# EasyEDA schematic SCH_Beginner project_2021-07-14.json
TITLE: Sheet_1; REV: 1.0; Date: 2021-06-19; Sheet: 1/1; Drawn By: jtan478; Company: Your Company
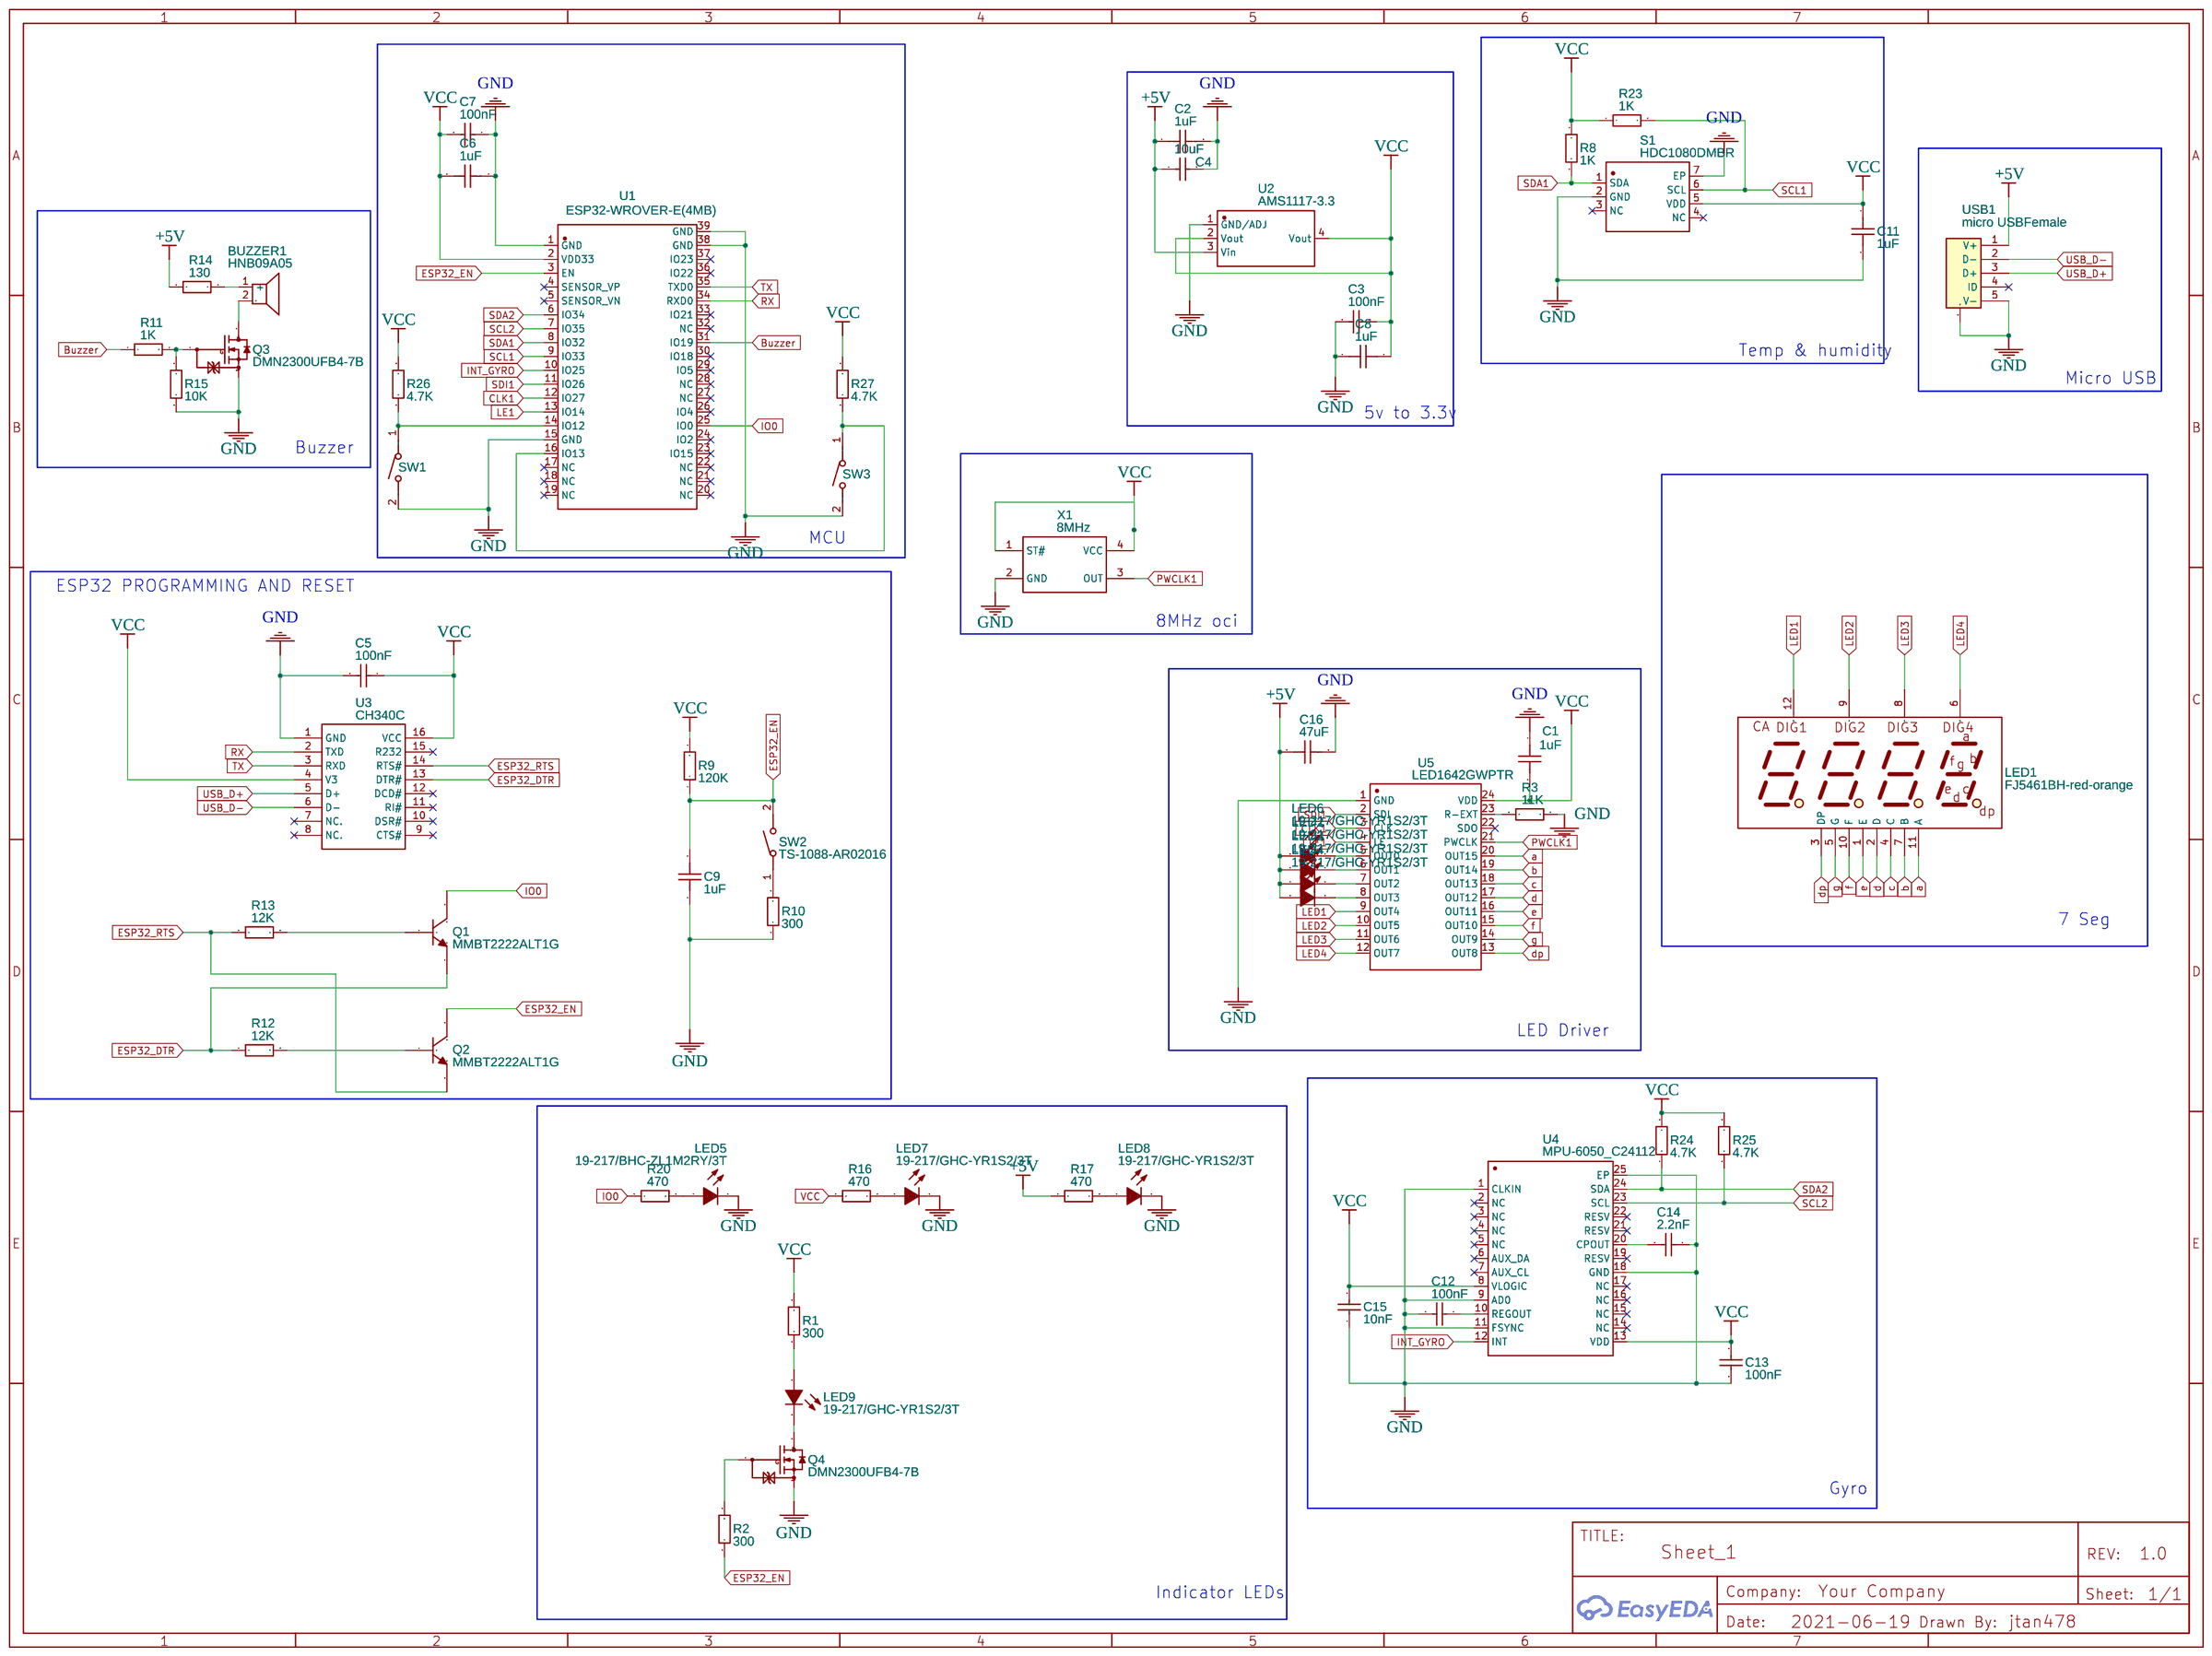
[diagram p0: schematic sheet]

## Parts
BUZZER1  HNB09A05  [BUZ-TH_BD9.6-P5.00-D0.7-FD]
C1  1uF  [C0402]
C2  1uF  [C0402]
C3  100nF  [C0402]
C4  10uF  [C0402]
C5  100nF  [C0402]
C6  1uF  [C0402]
C7  100nF  [C0402]
C8  1uF  [C0402]
C9  1uF  [C0402]
C11  1uF  [C0402]
C12  100nF  [C0402]
C13  100nF  [C0402]
C14  2.2nF  [C0402]
C15  10nF  [C0402]
C16  47uF  [C1206]
LED1  FJ5461BH-red-orange  [LED-SEG-TH_FJ5461AH]
LED2  19-217/GHC-YR1S2/3T  [LED0603-R-RD]
LED3  19-217/GHC-YR1S2/3T  [LED0603-R-RD]
LED4  19-217/GHC-YR1S2/3T  [LED0603-R-RD]
LED5  19-217/BHC-ZL1M2RY/3T  [LED0603-R-RD]
LED6  19-217/GHC-YR1S2/3T  [LED0603-R-RD]
LED7  19-217/GHC-YR1S2/3T  [LED0603-R-RD]
LED8  19-217/GHC-YR1S2/3T  [LED0603-R-RD]
LED9  19-217/GHC-YR1S2/3T  [LED0603-R-RD]
Q1  MMBT2222ALT1G  [SOT-23-3_L2.9-W1.3-P1.90-LS2.4-BR]
Q2  MMBT2222ALT1G  [SOT-23-3_L2.9-W1.3-P1.90-LS2.4-BR]
Q3  DMN2300UFB4-7B  [X2-DFN1006-3_L1.0-W0.6-P0.35-BL]
Q4  DMN2300UFB4-7B  [X2-DFN1006-3_L1.0-W0.6-P0.35-BL]
R1  300  [R0402]
R2  300  [R0402]
R3  11K  [R0603]
R8  1K  [R0603]
R9  120K  [R0402]
R10  300  [R0402]
R11  1K  [R0603]
R12  12K  [R0402]
R13  12K  [R0402]
R14  130  [R0603]
R15  10K  [R0603]
R16  470  [R0402]
R17  470  [R0402]
R20  470  [R0402]
R23  1K  [R0603]
R24  4.7K  [R0402]
R25  4.7K  [R0402]
R26  4.7K  [R0402]
R27  4.7K  [R0402]
S1  HDC1080DMBR  [SENSOR-SMD_HDC1080DMBR]
SW1  TS-1088-AR02016  [SW-SMD_L4.0-W2.9-LS5.0]
SW2  TS-1088-AR02016  [SW-SMD_L4.0-W2.9-LS5.0]
SW3  TS-1088-AR02016  [SW-SMD_L4.0-W2.9-LS5.0]
U1  ESP32-WROVER-E(4MB)  [WIFIM-SMD_39P-L31.4-W18.0-P1.27]
U2  AMS1117-3.3  [SOT-223-3_L6.5-W3.4-P2.30-LS7.0-BR]
U3  CH340C  [SOP-16_L10.0-W3.9-P1.27-LS6.0-BL]
U4  MPU-6050_C24112  [QFN-24_L4.0-W4.0-P0.50-BL-EP2.6]
U5  LED1642GWPTR  [QSOP-24_L8.7-W4.0-P0.65-LS6.0-BL]
USB1  micro USBFemale  [MICRO-USB-SMD_5P-P0.65-H-F_C10418]
X1  8MHz  [OSC-SMD_4P-L3.2-W2.5-BL]

## Library data of the parts
BUZZER1 = HNB09A05: Supplier: LCSC; Manufacturer: HNDZ; Supplier Part: C96493; JLCPCB Part Class: Extended Part
C1 C2 C8 C11 = CL05A105KA5NQNC: Supplier: LCSC; Manufacturer: SAMSUNG; Supplier Part: C52923; JLCPCB Part Class: Basic Part
C3 C5 C7 C12 C13 = CL05B104KO5NNNC: Supplier: LCSC; Manufacturer: SAMSUNG; LCSC Assembly: Yes; Supplier Part: C1525; SMT Type: Basic
C4 = CL05A106MQ5NUNC: Supplier: LCSC; Manufacturer: SAMSUNG; Supplier Part: C15525; JLCPCB Part Class: Basic Part
C6 C9 = CL05A105KA5NQNC: Supplier: LCSC; Manufacturer: SAMSUNG; LCSC Assembly: Yes; Supplier Part: C52923; SMT Type: Basic
C14 = 0402B222K500NT: Supplier: LCSC; Manufacturer: FH; LCSC Assembly: Yes; Supplier Part: C1531; SMT Type: Basic
C15 = CL05B103KB5NNNC: Supplier: LCSC; Manufacturer: SAMSUNG; Supplier Part: C15195; JLCPCB Part Class: Basic Part
C16 = CL31A476MPHNNNE: Supplier: LCSC; Manufacturer: SAMSUNG; Supplier Part: C96123; JLCPCB Part Class: Basic Part
LED1 = FJ5461BH-red-orange: Supplier: LCSC; Manufacturer: ReliaPro; Manufacturer Part: FJ5461BH 橙红; Supplier Part: C10713; JLCPCB Part Class: Extended Part
LED2-LED4 LED6-LED9 = 19-217/GHC-YR1S2/3T: Supplier: LCSC; Manufacturer: EVERLIGHT; Supplier Part: C72043; JLCPCB Part Class: Basic Part
LED5 = 19-217/BHC-ZL1M2RY/3T: Supplier: LCSC; Manufacturer: EVERLIGHT; Supplier Part: C72041; JLCPCB Part Class: Basic Part
Q1 Q2 = MMBT2222ALT1G: Supplier: LCSC; Manufacturer: ON; image: //image.lceda.cn/szlcsc/C82460.jpg; Supplier Part: C82460; LCSC Assembly: Yes; SMT Type: Extend
Q3 Q4 = DMN2300UFB4-7B: Supplier: LCSC; Manufacturer: DIODES; Contributor: LCSC; Supplier Part: C154728; JLCPCB Part Class: Extended Part
R1 R2 R10 = 0402WGF3000TCE: Supplier: LCSC; Manufacturer: UniOhm; LCSC Assembly: Yes; Supplier Part: C25102; SMT Type: Basic
R3 = 0603WAF1102T5E: Supplier: LCSC; Manufacturer: UniOhm; Supplier Part: C25950; JLCPCB Part Class: Basic Part
R8 R11 R23 = 0603WAF1001T5E: Supplier: LCSC; Manufacturer: UniOhm; Supplier Part: C21190; JLCPCB Part Class: Basic Part
R9 = 0402WGF1203TCE: Supplier: LCSC; Manufacturer: UniOhm; LCSC Assembly: Yes; Supplier Part: C25750; SMT Type: Basic
R12 R13 = 0402WGF1202TCE: Supplier: LCSC; Manufacturer: UniOhm; LCSC Assembly: Yes; Supplier Part: C25752; SMT Type: Basic
R14 = 0603WAF1300T5E: Supplier: LCSC; Manufacturer: UniOhm; Supplier Part: C22796; JLCPCB Part Class: Basic Part
R15 = 0603WAF1002T5E: Supplier: LCSC; Manufacturer: UniOhm; Supplier Part: C25804; JLCPCB Part Class: Basic Part
R16 R17 R20 = 0402WGF4700TCE: Supplier: LCSC; Manufacturer: UniOhm; LCSC Assembly: Yes; Supplier Part: C25117; SMT Type: Basic
R24-R27 = 0402WGF4701TCE: Supplier: LCSC; Manufacturer: UniOhm; LCSC Assembly: Yes; Supplier Part: C25900; SMT Type: Basic
S1 = HDC1080DMBR: Supplier: LCSC; Manufacturer: TI; Supplier Part: C82227; JLCPCB Part Class: Extended Part
SW1-SW3 = TS-1088-AR02016: Supplier: LCSC; Supplier Part: C720477; Manufacturer: XUNPU; Contributor: LCSC; LCSC Assembly: Yes; SMT Type: Extend; Assembly Type: smtWeld; Paste Type: expand
U1 = ESP32-WROVER-E(4MB): Supplier: LCSC; Supplier Part: C529587; Manufacturer: Espressif Systems; Contributor: LCSC; JLCPCB Part Class: Extended Part
U2 = AMS1117-3.3: sourceId: dwIGgezVh; Supplier: LCSC; Manufacturer: AMS; Supplier Part: C6186; JLCPCB Part Class: Basic Part
U3 = CH340C: Supplier: LCSC; Manufacturer: WCH; Supplier Part: C84681; LCSC Assembly: Yes; SMT Type: Extend
U4 = MPU-6050_C24112: sourceId: 1T5FDZYC8; Supplier: LCSC; Manufacturer: InvenSense; Manufacturer Part: MPU-6050; Supplier Part: C24112; JLCPCB Part Class: Basic Part
U5 = LED1642GWPTR: Supplier: LCSC; Manufacturer: STMicroelectronics; Supplier Part: C131193; JLCPCB Part Class: Extended Part
USB1 = micro USBFemale: Supplier: LCSC; Manufacturer: ValuePro; Supplier Part: C10418; JLCPCB Part Class: Extended Part
X1 = Q33310F70055100: Supplier: LCSC; Manufacturer: EPSON; Supplier Part: C70556; JLCPCB Part Class: Extended Part

## Nets
+5V: C2.1 C4.1 C16.1 LED2.1(A) LED3.1(A) LED4.1(A) LED6.1(A) R14.1 R17.1 U2.3(Vin) USB1.1(V+)
GND: C1.1 C2.2 C3.2 C4.2 C5.2 C6.1 C7.1 C8.1 C9.1 C11.2 C12.2 C13.2 C14.1 C15.1 C16.2 LED5.2(C) LED7.2(C) LED8.2(C) Q3.3(S) Q4.3(S) R3.2 R10.1 R15.2 S1.2(GND) S1.7(EP) SW1.2 SW3.2 U1.1(GND) U1.15(GND) U1.38(GND) U1.39(GND) U2.1(GND/ADJ) U3.1(GND) U4.1(CLKIN) U4.9(AD0) U4.11(FSYNC) U4.18(GND) U4.25(EP) U5.1(GND) USB1.0(MTN) USB1.5(V-) X1.2(GND)
VCC: C1.2 C3.1 C5.1 C6.2 C7.2 C8.2 C11.1 C13.1 C15.2 R1.2 R8.1 R9.2 R16.1 R23.1 R24.2 R25.2 R26.2 R27.2 S1.5(VDD) U1.2(VDD33) U2.2(Vout) U2.4(Vout) U3.4(V3) U3.16(VCC) U4.8(VLOGIC) U4.13(VDD) U5.24(VDD) X1.1(ST#) X1.4(VCC)
a: LED1.11(A) U5.20(OUT15)
b: LED1.7(B) U5.19(OUT14)
Buzzer: R11.1 U1.31(IO19)
c: LED1.4(C) U5.18(OUT13)
CLK1: U1.12(IO27) U5.3(CLK)
d: LED1.2(D) U5.17(OUT12)
dp: LED1.3(DP) U5.13(OUT8)
e: LED1.1(E) U5.16(OUT11)
ESP32_DTR: Q1.2(E) R12.1 U3.13(DTR#)
ESP32_EN: C9.2 Q2.3(C) R2.1 R9.1 SW2.2 U1.3(EN)
ESP32_RTS: Q2.2(E) R13.1 U3.14(RTS#)
f: LED1.10(F) U5.15(OUT10)
g: LED1.5(G) U5.14(OUT9)
INT_GYRO: U1.10(IO25) U4.12(INT)
IO0: Q1.3(C) R20.1 U1.25(IO0)
LE1: U1.13(IO14) U5.4(LE)
LED1: LED1.12(DIG1) U5.9(OUT4)
LED2: LED1.9(DIG2) U5.10(OUT5)
LED3: LED1.8(DIG3) U5.11(OUT6)
LED4: LED1.6(DIG4) U5.12(OUT7)
PWCLK1: U5.21(PWCLK) X1.3(OUT)
RX: U1.34(RXD0) U3.2(TXD)
SCL1: R23.2 S1.6(SCL) U1.9(IO33)
SCL2: R25.1 U1.7(IO35) U4.23(SCL)
SDA1: R8.2 S1.1(SDA) U1.8(IO32)
SDA2: R24.1 U1.6(IO34) U4.24(SDA)
SDI1: U1.11(IO26) U5.2(SDI)
TX: U1.35(TXD0) U3.3(RXD)
USB_D+: U3.5(D+) USB1.3(D+)
USB_D-: U3.6(D-) USB1.2(D-)
Net-(BUZZER1-1): BUZZER1.1(+) R14.2
Net-(BUZZER1-2): BUZZER1.2 Q3.2(D)
Net-(C12-1): C12.1 U4.10(REGOUT)
Net-(C14-2): C14.2 U4.20(CPOUT)
Net-(LED2-2): LED2.2(C) U5.6(OUT1)
Net-(LED3-2): LED3.2(C) U5.7(OUT2)
Net-(LED4-2): LED4.2(C) U5.8(OUT3)
Net-(LED5-1): LED5.1(A) R20.2
Net-(LED6-2): LED6.2(C) U5.5(OUT0)
Net-(LED7-1): LED7.1(A) R16.2
Net-(LED8-1): LED8.1(A) R17.2
Net-(LED9-1): LED9.1(A) R1.1
Net-(LED9-2): LED9.2(C) Q4.2(D)
Net-(Q1-1): Q1.1(B) R13.2
Net-(Q2-1): Q2.1(B) R12.2
Net-(Q3-1): Q3.1(G) R11.2 R15.1
Net-(Q4-1): Q4.1(G) R2.2
Net-(R3-1): R3.1 U5.23(R-EXT)
Net-(R10-2): R10.2 SW2.1
Net-(R26-1): R26.1 SW1.1 U1.14(IO12)
Net-(R27-1): R27.1 SW3.1 U1.16(IO13)

Not connected (* = marked no-connect by the designer): S1 3(NC)* 4(NC)*; U1 4(SENSOR_VP)* 5(SENSOR_VN)* 17(NC)* 18(NC)* 19(NC)* 20(NC)* 21(NC)* 22(NC)* 23(IO15)* 24(IO2)* 26(IO4)* 27(NC)* 28(NC)* 29(IO5)* 30(IO18)* 32(NC)* 33(IO21)* 36(IO22)* 37(IO23)*; U3 7(NC.)* 8(NC.)* 9(CTS#)* 10(DSR#)* 11(RI#)* 12(DCD#)* 15(R232)*; U4 2(NC)* 3(NC)* 4(NC)* 5(NC)* 6(AUX_DA)* 7(AUX_CL)* 14(NC)* 15(NC)* 16(NC)* 17(NC)* 19(RESV)* 21(RESV)* 22(RESV)*; U5 22(SDO)*; USB1 4(ID)*

## Notes on the sheet
- Temp & humidity
- Micro USB
- 5v to 3.3v
- Buzzer
- MCU
- ESP32 PROGRAMMING AND RESET
- 8MHz oci
- 7 Seg
- LED Driver
- Gyro
- Indicator LEDs
